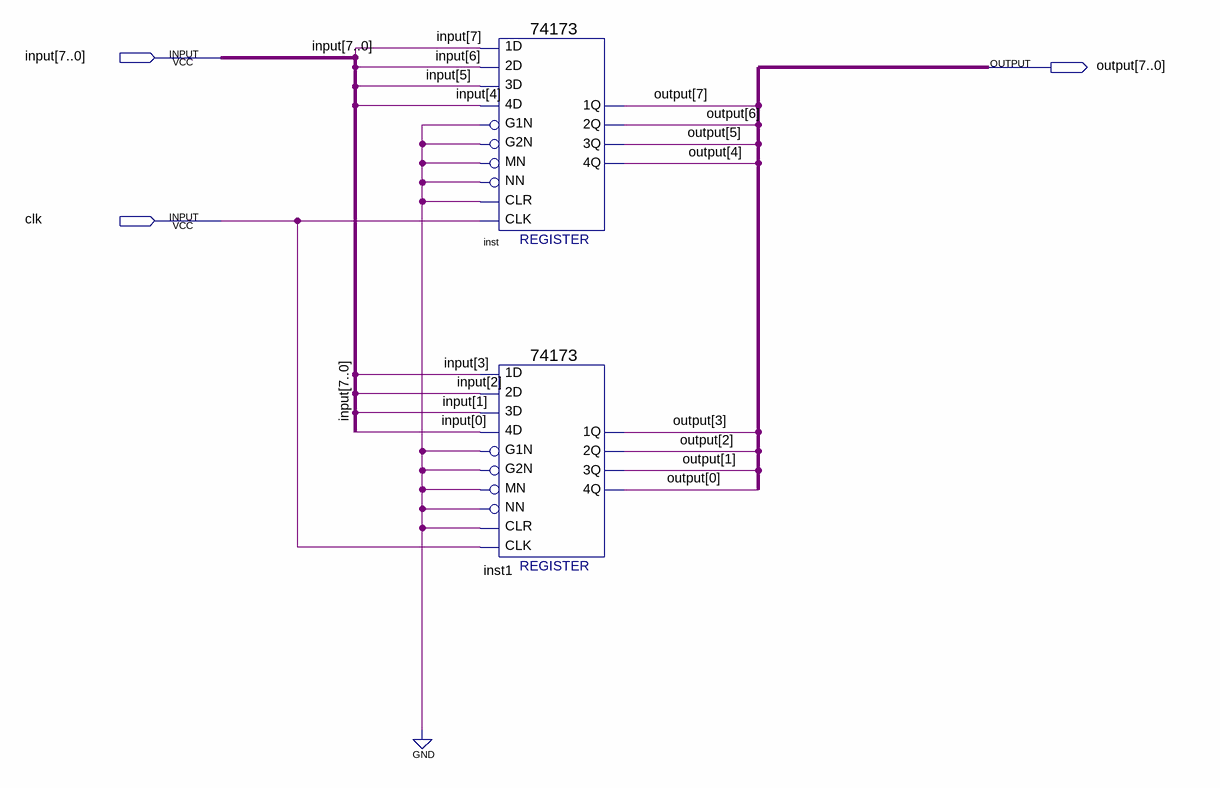
[diagram p0: schematic sheet]
// Quartus schematic register.bdf as structural Verilog: 2 symbols, 3 pins
module register (
  input  [7:0] \input ,
  input  clk,
  output [7:0] \output 
);

  \74173  inst (
    .\3D (\input [5]), .MN(1'b0), .\1D (\input [7]), .\2D (\input [6]), .\4D (\input [4]), .G1N(1'b0),
    .G2N(1'b0), .NN(1'b0), .CLR(1'b0), .CLK(clk), .\3Q (\output [5]), .\2Q (\output [6]), .\1Q (\output [7]),
    .\4Q (\output [4]));
  \74173  inst1 (
    .\3D (\input [1]), .MN(1'b0), .\1D (\input [3]), .\2D (\input [2]), .\4D (\input [0]), .G1N(1'b0),
    .G2N(1'b0), .NN(1'b0), .CLR(1'b0), .CLK(clk), .\3Q (\output [1]), .\2Q (\output [2]), .\1Q (\output [3]),
    .\4Q (\output [0]));
endmodule
